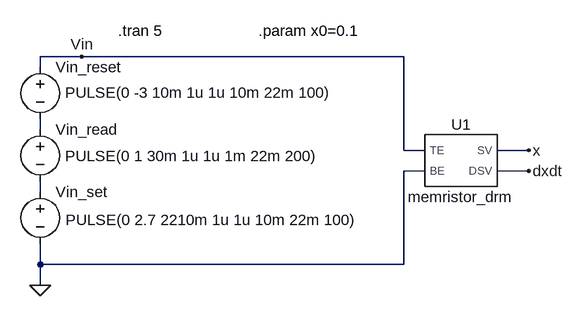
[diagram p0: schematic mem_drm.asc]
mem_drm.asc, the LTspice schematic file:
Version 4
SHEET 1 1352 680
WIRE -144 -160 -208 -160
WIRE 352 -160 -144 -160
WIRE -208 -144 -208 -160
WIRE -208 -48 -208 -64
WIRE 352 -16 352 -160
WIRE 384 -16 352 -16
WIRE 544 -16 496 -16
WIRE 384 16 352 16
WIRE 544 16 496 16
WIRE -208 48 -208 32
WIRE -208 160 -208 128
WIRE 352 160 352 16
WIRE 352 160 -208 160
WIRE -208 192 -208 160
FLAG -208 192 0
FLAG 544 -16 x
FLAG 544 16 dxdt
FLAG -144 -160 Vin
SYMBOL voltage -208 -160 R0
WINDOW 123 0 0 Left 0
WINDOW 39 0 0 Left 0
WINDOW 3 38 55 Left 2
SYMATTR Value PULSE(0 -3 10m 1u 1u 10m 22m 100)
SYMATTR InstName Vin_reset
SYMBOL voltage -208 -64 R0
WINDOW 3 38 57 Left 2
WINDOW 123 0 0 Left 0
WINDOW 39 0 0 Left 0
SYMATTR Value PULSE(0 1 30m 1u 1u 1m 22m 200)
SYMATTR InstName Vin_read
SYMBOL voltage -208 32 R0
WINDOW 3 39 59 Left 2
WINDOW 123 0 0 Left 0
WINDOW 39 0 0 Left 0
SYMATTR Value PULSE(0 2.7 2210m 1u 1u 10m 22m 100)
SYMATTR InstName Vin_set
SYMBOL memristor_drm 432 0 R0
SYMATTR InstName U1
TEXT -88 -200 Left 2 !.tran 5
TEXT 128 -200 Left 2 !.param x0=0.1

The netlist it stands for:
* mem_drm.asc
Vin_reset Vin N001 PULSE(0 -3 10m 1u 1u 10m 22m 100)
Vin_read N001 N002 PULSE(0 1 30m 1u 1u 1m 22m 200)
Vin_set N002 0 PULSE(0 2.7 2210m 1u 1u 10m 22m 100)
XU1 Vin 0 x dxdt memristor_drm  ; pins TE BE SV DSV
.tran 5
.param x0=0.1
.lib memristor_drm.cir
.backanno
.end